# Altium project D5035-51.PrjPcb
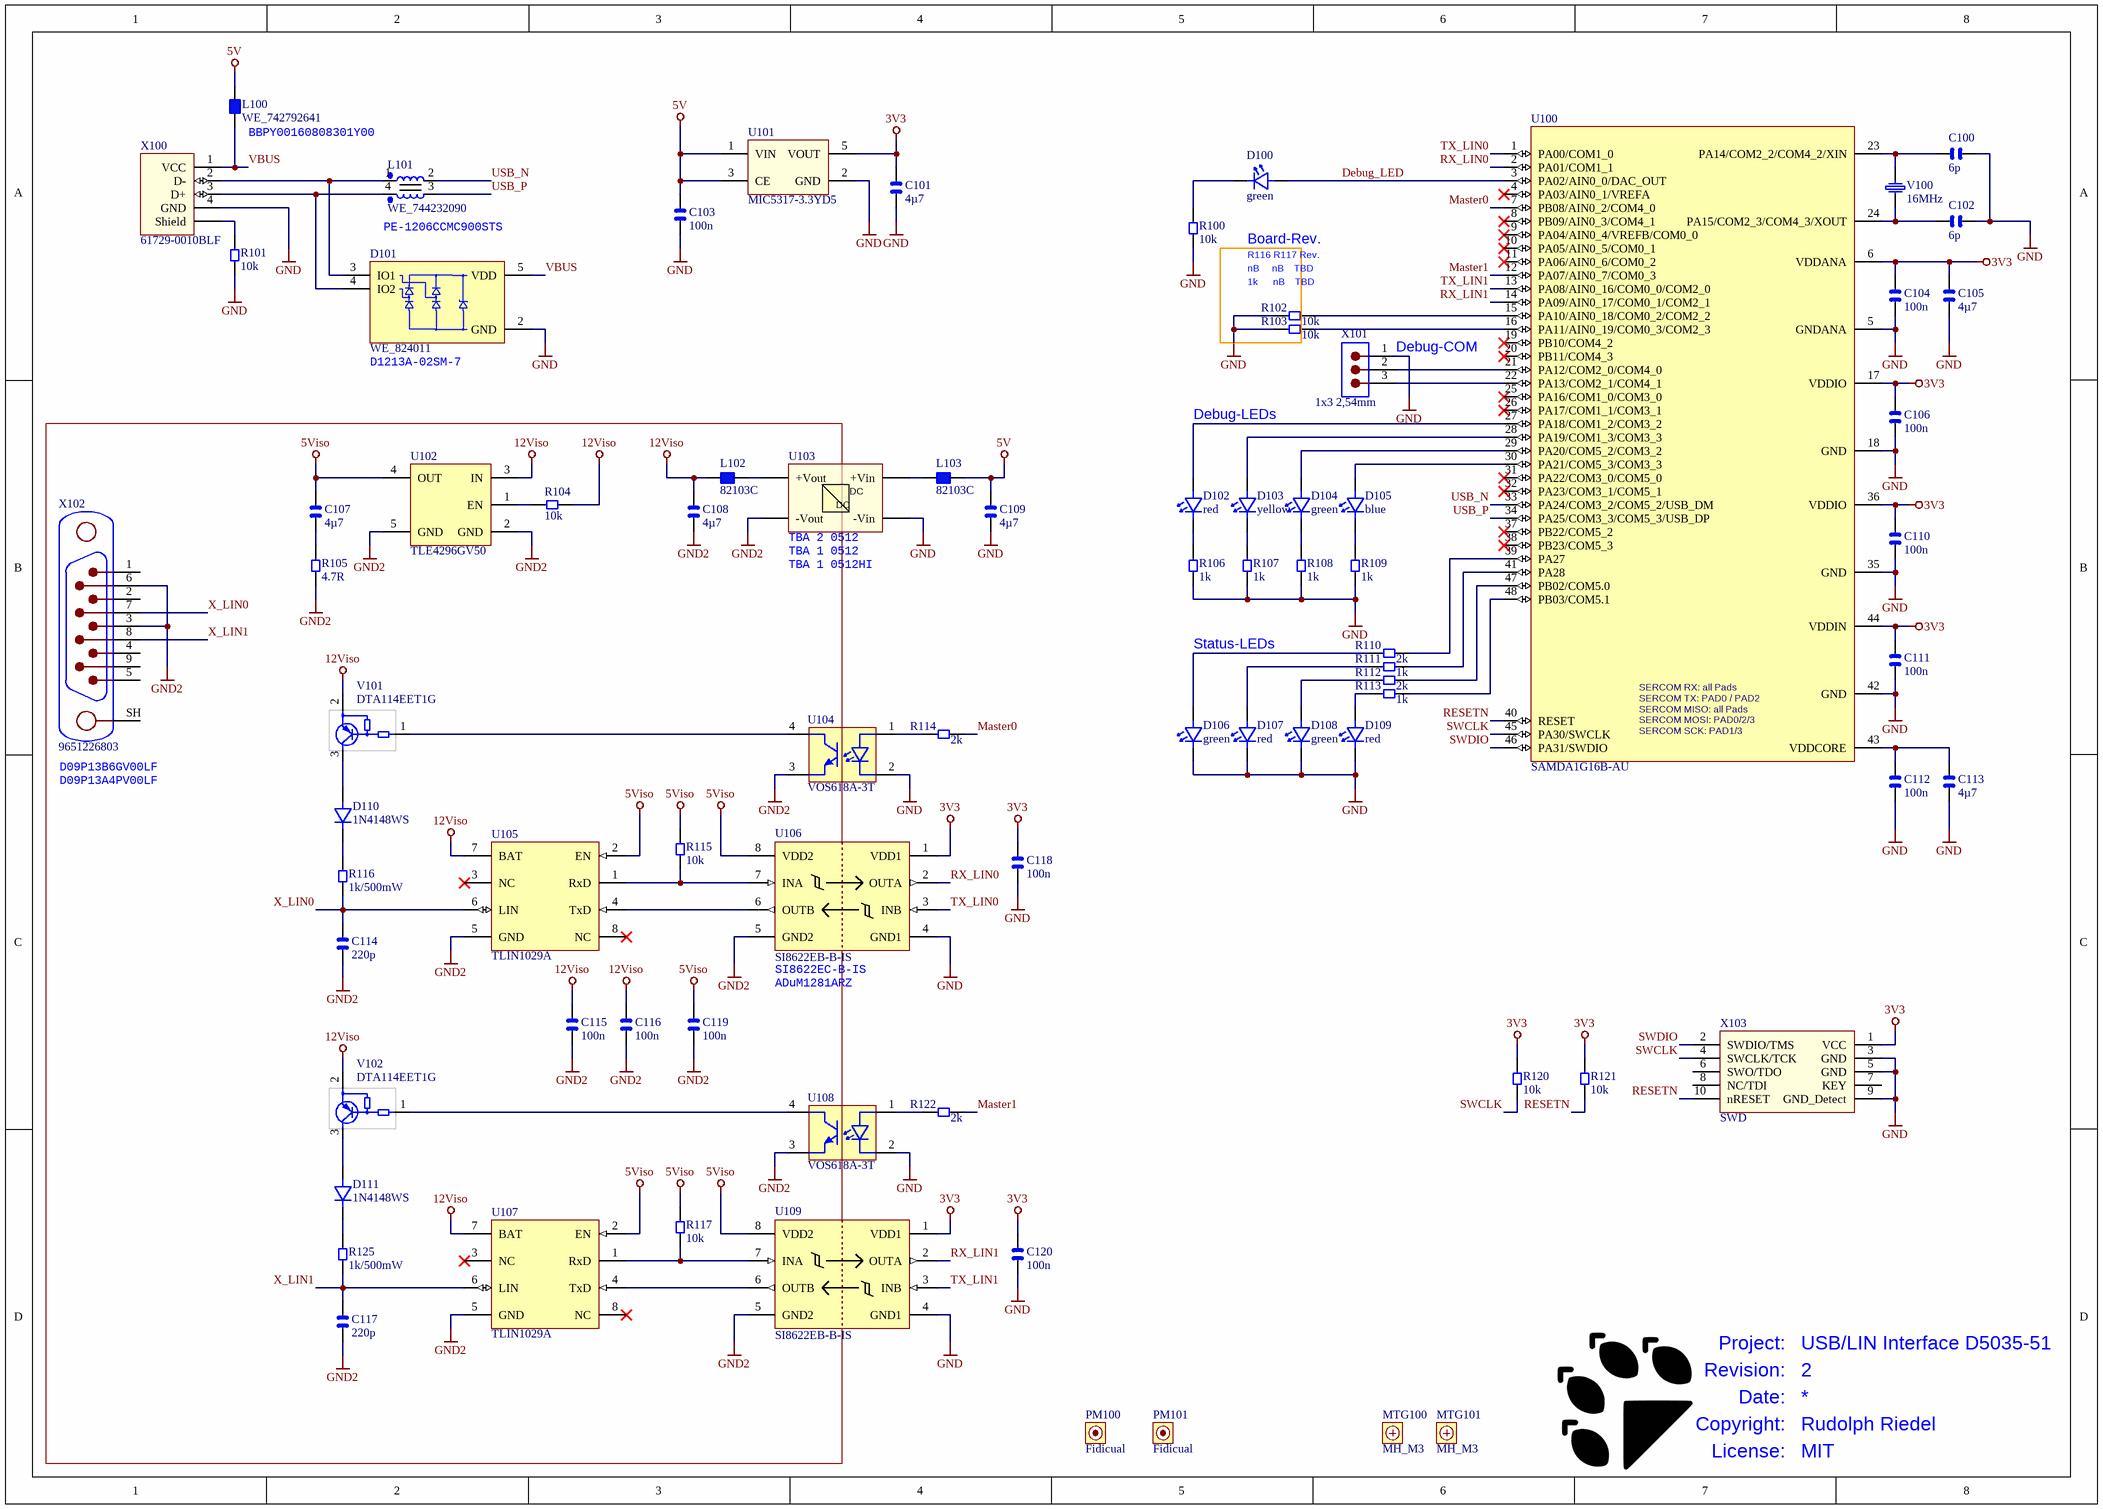
[diagram p0: D5035-51.SchDoc]
1 sheet, 80 parts. Net scope: global (net labels, ports and power ports of the same name join across sheets).
Board file: D5035_51.PcbDoc

## Sheet D5035-51.SchDoc: USB/LIN Interface D5035-51
size A3; Organization: Organization; Address1: Address1; Address2: Address2; Address3: Address3; Address4: Address4; DocumentNumber: 1; Revision: 2; SheetNumber: 1; SheetTotal: 1; PageSetup: Record=PageOptions|CenterHorizontal=True|CenterVertical=True|PrintScale=1.00|XCorrection=1.00|YCorrection=1.00|PrintKind=1|BorderSize=5000000|LeftOffset=0|BottomOffset=0|Orientation=2|PaperLength=1000|PaperWidth=1000|Scale=100|PaperSource=7|PrintQuality=-4|MediaType=1|DitherType=10|PaperKind=A3|PrintScaleMode=0

### Parts
C100  6p  [CAPC1608X09L]
C101  4µ7  [CAPC2012X14L]
C102  6p  [CAPC1608X09L]
C103  100n  [CAPC1608X09L]
C104  100n  [CAPC1608X09L]
C105  4µ7  [CAPC2012X14L]
C106  100n  [CAPC1608X09L]
C107  4µ7  [CAPC2012X14L]
C108  4µ7  [CAPC2012X14L]
C109  4µ7  [CAPC2012X14L]
C110  100n  [CAPC1608X09L]
C111  100n  [CAPC1608X09L]
C112  100n  [CAPC1608X09L]
C113  4µ7  [CAPC2012X14L]
C114  220p  [CAPC2012X14L]
C115  100n  [CAPC1608X09L]
C116  100n  [CAPC1608X09L]
C117  220p  [CAPC2012X14L]
C118  100n  [CAPC1608X09L]
C119  100n  [CAPC1608X09L]
C120  100n  [CAPC1608X09L]
D100  green  [DIOC1608X06N_LED]
D101  WE_824011  [SOT95P280X110-5N]
D102  red  [DIOC1608X06N_LED]
D103  yellow  [DIOC1608X06N_LED]
D104  green  [DIOC1608X06N_LED]
D105  blue  [DIOC1608X06N_LED]
D106  green  [DIOC1608X06N_LED]
D107  red  [DIOC1608X06N_LED]
D108  green  [DIOC1608X06N_LED]
D109  red  [DIOC1608X06N_LED]
D110  1N4148WS  [SOD323]
D111  1N4148WS  [SOD323]
L100  WE_742792641  [INDC1608X06L]
L101  WE_744232090  [WE_744232090]
L102  82103C  [Murata_8200C]
L103  82103C  [Murata_8200C]
MTG100  MH_M3  [HOLE_3_2MM]  (no BOM)
MTG101  MH_M3  [HOLE_3_2MM]  (no BOM)
PM100  Fidicual  [PM100]  (no BOM)
PM101  Fidicual  [PM100]  (no BOM)
R100  10k  [RESC1608X06L]
R101  10k  [RESC1608X06L]
R102  10k  [RESC1608X06L]
R103  10k  [RESC1608X06L]
R104  10k  [RESC1608X06L]
R105  4.7R  [RESC1608X06L]
R106  1k  [RESC1608X06L]
R107  1k  [RESC1608X06L]
R108  1k  [RESC1608X06L]
R109  1k  [RESC1608X06L]
R110  2k  [RESC1608X06L]
R111  1k  [RESC1608X06L]
R112  2k  [RESC1608X06L]
R113  1k  [RESC1608X06L]
R114  2k  [RESC1608X06L]
R115  10k  [RESC1608X06L]
R116  1k/500mW  [RESC2012X06L]
R117  10k  [RESC1608X06L]
R120  10k  [RESC1608X06L]
R121  10k  [RESC1608X06L]
R122  2k  [RESC1608X06L]
R125  1k/500mW  [RESC2012X06L]
U100  SAMDA1G16B-AU  [TQFP50P900X900X120-48N]
U101  MIC5317-3.3YD5  [SOT95P280X110-5N]
U102  TLE4296GV50  [INF-PG-SCT595V]
U103  (no value)  [TBA1/TBA2]
U104  VOS618A-3T  [SSOP-4]
U105  TLIN1029A  [SOIC127P600X175-8N]
U106  SI8622EB-B-IS  [SOIC127P600X175-8N]
U107  TLIN1029A  [SOIC127P600X175-8N]
U108  VOS618A-3T  [SSOP-4]
U109  SI8622EB-B-IS  [SOIC127P600X175-8N]
V100  16MHz  [NX3225Gx]
V101  DTA114EET1G  [SOT50P162X60-3N]
V102  DTA114EET1G  [SOT50P162X60-3N]
X100  61729-0010BLF  [61729-xxxxxLF]
X101  1x3 2,54mm  [PINH_1x03_2_54mm]
X102  9651226803  [09651226803]
X103  SWD  [FTSH-105-01-L-DV-K]

### Blocks framed on the sheet
Board-Rev.: R102 R103

### Nets
3V3: C101.2 C104.2 C105.2 C106.2 C110.2 C111.2 C118.2 C120.2 R120.1 R121.1 U100.6(VDDANA) U100.17(VDDIO) U100.36(VDDIO) U100.44(VDDIN) U101.5(VOUT) U106.1(VDD1) U109.1(VDD1) X103.1(VCC)
5V: C103.2 C109.2 L100.2 L103.1 U101.1(VIN) U101.3(CE)
5Viso: C107.2 C119.2 R115.1 R117.1 U102.4(OUT) U105.2(EN) U106.8(VDD2) U107.2(EN) U109.8(VDD2)
12Viso: C108.2 C115.2 C116.2 L102.2 R104.2 U102.3(IN) U105.7(BAT) U107.7(BAT) V101.2 V102.2
GND: C100.2 C101.1 C102.2 C103.1 C104.1 C105.1 C106.1 C109.1 C110.1 C111.1 C112.1 C113.1 C118.1 C120.1 D101.2(GND) D106.1 D107.1 D108.1 D109.1 R100.1 R101.1 R102.2 R103.2 R106.1 R107.1 R108.1 R109.1 U100.5(GNDANA) U100.18(GND) U100.35(GND) U100.42(GND) U101.2(GND) U103.2(-Vin) U104.2(C) U106.4(GND1) U108.2(C) U109.4(GND1) X100.4(GND) X101.1 X103.3(GND) X103.5(GND) X103.9(GND_Detect)
GND2: C108.1 C114.1 C115.1 C116.1 C117.1 C119.1 R105.2 U102.2(GND) U102.5(GND) U103.4(-Vout) U104.3(E) U105.5(GND) U106.5(GND2) U107.5(GND) U108.3(E) U109.5(GND2) X102.3 X102.6
Debug_LED: D100.2 U100.3(PA02/AIN0_0/DAC_OUT)
Master0: R114.1 U100.7(PB08/AIN0_2/COM4_0)
Master1: R122.1 U100.12(PA07/AIN0_7/COM0_3)
RESETN: R121.2 U100.40(RESET) X103.10(nRESET)
RX_LIN0: U100.2(PA01/COM1_1) U106.2(OUTA)
RX_LIN1: U100.14(PA09/AIN0_17/COM0_1/COM2_1) U109.2(OUTA)
SWCLK: R120.2 U100.45(PA30/SWCLK) X103.4(SWCLK/TCK)
SWDIO: U100.46(PA31/SWDIO) X103.2(SWDIO/TMS)
TX_LIN0: U100.1(PA00/COM1_0) U106.3(INB)
TX_LIN1: U100.13(PA08/AIN0_16/COM0_0/COM2_0) U109.3(INB)
USB_N: L101.2 U100.33(PA24/COM3_2/COM5_2/USB_DM)
USB_P: L101.3 U100.34(PA25/COM3_3/COM5_3/USB_DP)
VBUS: D101.5(VDD) L100.1 X100.1(VCC)
X_LIN0: C114.2 R116.1 U105.6(LIN) X102.7
X_LIN1: C117.2 R125.1 U107.6(LIN) X102.8
NetC100_1: C100.1 U100.23(PA14/COM2_2/COM4_2/XIN) V100.2
NetC102_1: C102.1 U100.24(PA15/COM2_3/COM4_3/XOUT) V100.1
NetC107_1: C107.1 R105.1
NetC112_2: C112.2 C113.2 U100.43(VDDCORE)
NetD100_1: D100.1 R100.2
NetD101_3: D101.3(IO1) L101.1 X100.2(D-)
NetD101_4: D101.4(IO2) L101.4 X100.3(D+)
NetD102_1: D102.1 R106.2
NetD102_2: D102.2 U100.27(PA18/COM1_2/COM3_2)
NetD103_1: D103.1 R107.2
NetD103_2: D103.2 U100.28(PA19/COM1_3/COM3_3)
NetD104_1: D104.1 R108.2
NetD104_2: D104.2 U100.29(PA20/COM5_2/COM3_2)
NetD105_1: D105.1 R109.2
NetD105_2: D105.2 U100.30(PA21/COM5_3/COM3_3)
NetD106_2: D106.2 R110.1
NetD107_2: D107.2 R111.1
NetD108_2: D108.2 R112.1
NetD109_2: D109.2 R113.1
NetD110_1: D110.1 R116.2
NetD110_2: D110.2 V101.3
NetD111_1: D111.1 R125.2
NetD111_2: D111.2 V102.3
NetL102_1: L102.1 U103.6(+Vout)
NetL103_2: L103.2 U103.1(+Vin)
NetR101_2: R101.2 X100.Shell(Shield)
NetR102_1: R102.1 U100.15(PA10/AIN0_18/COM0_2/COM2_2)
NetR103_1: R103.1 U100.16(PA11/AIN0_19/COM0_3/COM2_3)
NetR104_1: R104.1 U102.1(EN)
NetR110_2: R110.2 U100.39(PA27)
NetR111_2: R111.2 U100.41(PA28)
NetR112_2: R112.2 U100.47(PB02/COM5.0)
NetR113_2: R113.2 U100.48(PB03/COM5.1)
NetR114_2: R114.2 U104.1(A)
NetR115_2: R115.2 U105.1(RxD) U106.7(INA)
NetR117_2: R117.2 U107.1(RxD) U109.7(INA)
NetR122_2: R122.2 U108.1(A)
NetU100_21: U100.21(PA12/COM2_0/COM4_0) X101.2
NetU100_22: U100.22(PA13/COM2_1/COM4_1) X101.3
NetU104_4: U104.4(C) V101.1
NetU105_4: U105.4(TxD) U106.6(OUTB)
NetU107_4: U107.4(TxD) U109.6(OUTB)
NetU108_4: U108.4(C) V102.1

Not connected (* = marked no-connect by the designer): U100 4(PA03/AIN0_1/VREFA)* 8(PB09/AIN0_3/COM4_1)* 9(PA04/AIN0_4/VREFB/COM0_0)* 10(PA05/AIN0_5/COM0_1)* 11(PA06/AIN0_6/COM0_2)* 19(PB10/COM4_2)* 20(PB11/COM4_3)* 25(PA16/COM1_0/COM3_0)* 26(PA17/COM1_1/COM3_1)* 31(PA22/COM3_0/COM5_0)* 32(PA23/COM3_1/COM5_1)* 37(PB22/COM5_2)* 38(PB23/COM5_3)*; U105 3(NC)* 8(NC)*; U107 3(NC)* 8(NC)*; X102 1 2 4 5 9 SH; X103 6(SWO/TDO) 7(KEY) 8(NC/TDI)

### Notes on the sheet
- (near L100) BBPY00160808301Y00
- PE-1206CCMC900STS
- R116 R117 Rev.
- nB     nB    TBD
- 1k      nB    TBD
- (near D101) D1213A-02SM-7
- (near X101) Debug-COM
- Debug-LEDs
- (near U103) TBA 2 0512
- (near U103) TBA 1 0512
- (near U103) TBA 1 0512HI
- Status-LEDs
- (near X102) D09P13B6GV00LF
- D09P13A4PV00LF
- (near U106) ADuM1281ARZ
- (near U106) SI8622EC-B-IS
- Project:
- Revision:
- Date:
- Copyright:
- License:
- Rudolph Riedel
- MIT
- (in symbol MER1S0505SC) DC
- (in symbol SAMDA1G16B-AU) SERCOM RX: all Pads / SERCOM TX: PAD0 / PAD2 / SERCOM MISO: all Pads / SERCOM MOSI: PAD0/2/3 / SERCOM SCK: PAD1/3

### Library data of the parts
C100 C102-C104 C106 C110-C112 C115 C116 C118-C120 = CAPC_0603: 0603 Chip Capacitor; Editor: rriedel; Kategorie: generic; Unterart: unpolarized; Part Number: CAPC_0603; Status: tested; Bauteilart: Capacitor; PackageDescription: 0603
  C100 C102: Value: 6p
  C103 C104 C106 C110-C112 C115 C116 C118-C120: Value: 100n
C101 C105 C107-C109 C113 C114 C117 = CAPC_0805: 0805 Chip Capacitor; Editor: rriedel; Kategorie: generic; Unterart: unpolarized; Part Number: CAPC_0805; Status: tested; Bauteilart: Capacitor; PackageDescription: 0805
  C101 C105 C107-C109 C113: Value: 4µ7
  C114 C117: Value: 220p
D100 D102-D109 = LED_0603: LED, 0603; Editor: rriedel; Kategorie: generic; Bauteilart: Diode; Part Number: LED_0603; Status: new; Date: 29.06.2020; Unterart: generic; PackageDescription: 0603
  D100 D104 D106 D108: Value: green
  D102 D107 D109: Value: red
  D103: Value: yellow
  D105: Value: blue
D101 = WE_824011: TVS Diode Array WE-TVS; Manufacturer: Wuerth; Part_Number_1: 824011; Editor: rriedel; Kategorie: Part; Unterart: ESD; Part Number: WE_824011; Value: WE_824011; Status: new; Date: 22.06.2020; Bauteilart: Diode; PackageDescription: SOT23-5; Distributor_1: Digi-Key; Distributor_1_Part_Number: 732-4465-1-ND
D110 D111 = 1N4148WS: Small Signal Diode IF 0.15A, VR 75V, SOD323F; Editor: rriedel; Kategorie: Part; Part Number: 1N4148WS; Value: 1N4148WS; Status: new; Date: 14.03.2022; Bauteilart: Diode; Unterart: Small Signal; PackageDescription: SOD323F; Distributor_1: LCSC; Distributor_1_Part_Number: C2128
L100 = WE_742792641: SMT EMI suppression ferrite bead WE-CBF; Manufacturer: Wuerth; Editor: rriedel; Kategorie: Part; Bauteilart: Inductor; Part Number: WE_742792641; Value: WE_742792641; Status: new; Date: 22.06.2020; Unterart: Ferrite Bead; PackageDescription: 0603; Part_Number_1: 742792641; Distributor_1: Digi-Key; Distributor_1_Part_Number: 732-1592-1-ND
L101 = WE_744232090: SMD common mode noise suppressor WE-CNSW; Manufacturer: Wuerth; Editor: rriedel; Kategorie: Part; Bauteilart: Inductor; Unterart: Filter; Part Number: WE_744232090; Value: WE_744232090; Status: new; Date: 22.06.2020; PackageDescription: 3216; Part_Number_1: 744232090; Distributor_1: Digi-Key; Distributor_1_Part_Number: 732-1469-1-ND
L102 L103 = 82103C: 10µH, 0,5A, 400mR; Manufacturer: Murata; Editor: rriedel; Kategorie: Part; Bauteilart: Inductor; Unterart: Power; Part Number: 82103C; Value: 82103C; Status: new; Date: 27.06.2020; PackageDescription: 3,2x2,5 mm; Part_Number_1: 82103C; Distributor_1: Digi-Key; Distributor_1_Part_Number: 811-2473-1-ND
MTG100 MTG101 = MH_M3: Mounting-Hole for M3 screws; Editor: rriedel; Kategorie: No_Bom; Bauteilart: Mechanic; Unterart: Holes; Part Number: MH_M3; Value: MH_M3; Status: tested; Date: 13.05.2018
PM100 PM101 = PM100: Passermarke für Bestueckungsautomaten 1mm rund, 2,2mm quadratischer Ausschnitt, 2,1 mm Ausstellung Loetstoplack; Editor: rriedel; Kategorie: No_Bom; Bauteilart: Manufacturing; Part Number: PM100; Value: Fidicual; Status: tested; Date: 22.02.2017; Unterart: Passermarke; PackageDescription: Passermarke 1.0mm rund
R100-R115 R117 R120-R122 = RESC_0603: 0603 Chip Resistor; Editor: rriedel; Kategorie: generic; Part Number: RESC_0603; Status: tested; Bauteilart: Resistor; Unterart: generic; PackageDescription: 0603
  R100-R104 R115 R117 R120 R121: Value: 10k
  R105: Value: 4.7R
  R106-R109 R111 R113: Value: 1k
  R110 R112 R114 R122: Value: 2k
R116 R125 = RESC_0805: 0805 Chip Resistor; Editor: rriedel; Kategorie: generic; Part Number: RESC_0805; Value: 1k/500mW; Status: tested; Bauteilart: Resistor; Unterart: generic; PackageDescription: 0805
U100 = SAMDA1G16B-AU: 32-bit Microcontroller, 48MHz Cortex M0, 64k FLASH,  USB, -40…85°C; Manufacturer: Microchip; Editor: rriedel; Kategorie: Part; Bauteilart: MikroController; Unterart: 32bit Microchip; Part Number: SAMDA1G16B-AU; Value: SAMDA1G16B-AU; Status: new; Date: 22.05.2022; PackageDescription: TQFP48-0.5mm; Part_Number_1: SAMDA1G16B-AU; Distributor_1: Mouser; Distributor_1_Part_Number: 556-ATSAMDA1G16B-ABT; Distributor_2: Digi-Key; Distributor_2_Part_Number: ATSAMDA1G16B-ABTCT-ND
U101 = MIC5233-3.3: 100 mA LDO,  Vout= 3,3V, -40°C..125°C; Manufacturer: Microchip; Part_Number_1: MIC5233-3.3YM5; Editor: rriedel; Kategorie: Part; Bauteilart: IC; Unterart: Linear-Regulators; ComponenLinkDescription: Datasheet; Part Number: MIC5233-3.3; Value: MIC5317-3.3YD5; Status: tested; Date: 15.09.2016; PackageDescription: SOT23-5; Distributor_1: Farnell; Distributor_1_Part_Number: 2510274
U102 = TLE4296GV50: 30 mA LDO, Vout = 5,0V, 4%; Manufacturer: Infineon; Editor: rriedel; Kategorie: Part; Bauteilart: IC; Unterart: Linear-Regulators; ComponenLinkDescription: Datasheet; Part Field 2: SCT595-5; Part Number: TLE4296GV50; Value: TLE4296GV50; Status: new; Date: 07.03.2022; PackageDescription: SCT595; Part_Number_1: TLE4296GV50
U103 = MER1S0505SC: Isolated Single Output DC-DC Converters 5V/12V; Part Number: TBA 2-0512; Editor: rriedel; Kategorie: Part; Bauteilart: Module; Unterart: DCDC; Status: new; Date: 27.06.2020; PackageDescription: 4Pin SIP
U104 U108 = VOS618A-3T: Optocoupler, Phototransistor Output, Low Input Current, SSOP-4; Manufacturer: Vishay; Editor: rriedel; Kategorie: Part; Bauteilart: Opto; Part Number: VOS618A-3T; Value: VOS618A-3T; Status: new; Date: 28.02.2022; Unterart: Optocoupler; PackageDescription: SSOP-4; Part_Number_1: VOS618A-3T; Distributor_1: Digi-Key; Distributor_1_Part_Number: VOS618A-3TCT-ND‎
U105 U107 = TLIN1029A: LIN transceiver; Manufacturer: TI; Editor: rriedel; Kategorie: Part; Bauteilart: IC; Part Number: TLIN1029A; Value: TLIN1029A; Status: tested; Date: 27.02.2022; Unterart: LIN; PackageDescription: SO8; Part_Number_1: TLIN1029A; Distributor_1: Mouser; Distributor_1_Part_Number: 595-TLIN1029ADRQ1
U106 U109 = SI8622EB-B-IS: Dual channel digital isolator, 150Mbit, 2,5kV; Manufacturer: Silicon Labs; Editor: rriedel; Kategorie: Part; Bauteilart: IC; Part Number: SI8622EB-B-IS; Value: SI8622EB-B-IS; Status: tested; Date: 28.06.2020; Unterart: Isolator; PackageDescription: SO8; Part_Number_1: SI8622EB-B-IS; Distributor_1: Digi-Key; Distributor_1_Part_Number: 336-5209-1-ND
V100 = NX3225GB-16.000000MHZ: 16.000MHz Crystal SMD, 3.2x2.5mm, 8pF, 50ppm,  -40..+150°C; Manufacturer: NDK; Part_Number_1: NX3225GB-16M-STD-CRA-2; Editor: rriedel; Kategorie: Part; Unterart: NX3225GB automotive; Part Number: NX3225GB-16.000000MHZ; Value: 16MHz; Status: tested; Date: 22.10.2015; Bauteilart: Crystal; PackageDescription: NX3225Gx 3,2mm x 2,5mm; Distributor_1: Digi-Key; Distributor_1_Part_Number: 644-1233-1-ND; Distributor_2: Frischer
V101 V102 = DTA114EET1G: PNP Transistor with Resistors (10kΩ, 10kΩ)  VCE= 50V, IC=100mA, SOT23, AEC Q101; Editor: rriedel; Kategorie: Part; Part Number: DTA114EET1G; Value: DTA114EET1G; Status: new; Date: 19.12.2021; Bauteilart: Transistor; Unterart: PNP; PackageDescription: SC-75
X100 = 61729-0010BLF: USB-B socket, THT; Manufacturer: Amphenol; Editor: rriedel; Kategorie: Part; Bauteilart: Connector; Part Number: 61729-0010BLF; Value: 61729-0010BLF; Status: new; Date: 28.06.2020; Unterart: USB; PackageDescription: USB-B; Part_Number_1: 61729-0010BLF; Distributor_1: Digi-Key; Distributor_1_Part_Number: 609-1039-ND
X101 = PINH_1x3_2_54: Pin-Header 2,54 mm 3pins; Editor: rriedel; Kategorie: generic; Bauteilart: Connector; Part Number: PINH_1x3_2_54; Value: 1x3 2,54mm; Status: tested; Date: 02.02.2017; Unterart: Pin-Header
X102 = 9651226803: D-Sub, 9 pin, male, right angle; Manufacturer: Harting; Editor: rriedel; Kategorie: Part; Bauteilart: Connector; Part Number: 9651226803; Value: 9651226803; Status: new; Date: 29.06.2020; Unterart: D-Sub; PackageDescription: D-Sub; Part_Number_1: 9651226803; Distributor_1: Farnell; Distributor_1_Part_Number: 2752007
X103 = SWD: ARM Debug-Header 2x5 1,27 mm; Editor: rriedel; Kategorie: Part; Bauteilart: Connector; Unterart: Debug; Part Number: SWD; Value: SWD; Status: tested; Date: 12.08.2018; PackageDescription: 2x5 1,27mm

## Assembly variants
Release: not fitted D102 D103 D104 D105 R102 R103 R106 R107 R108 R109 X101